# EAGLE design Teensylu (EAGLE 5.11)
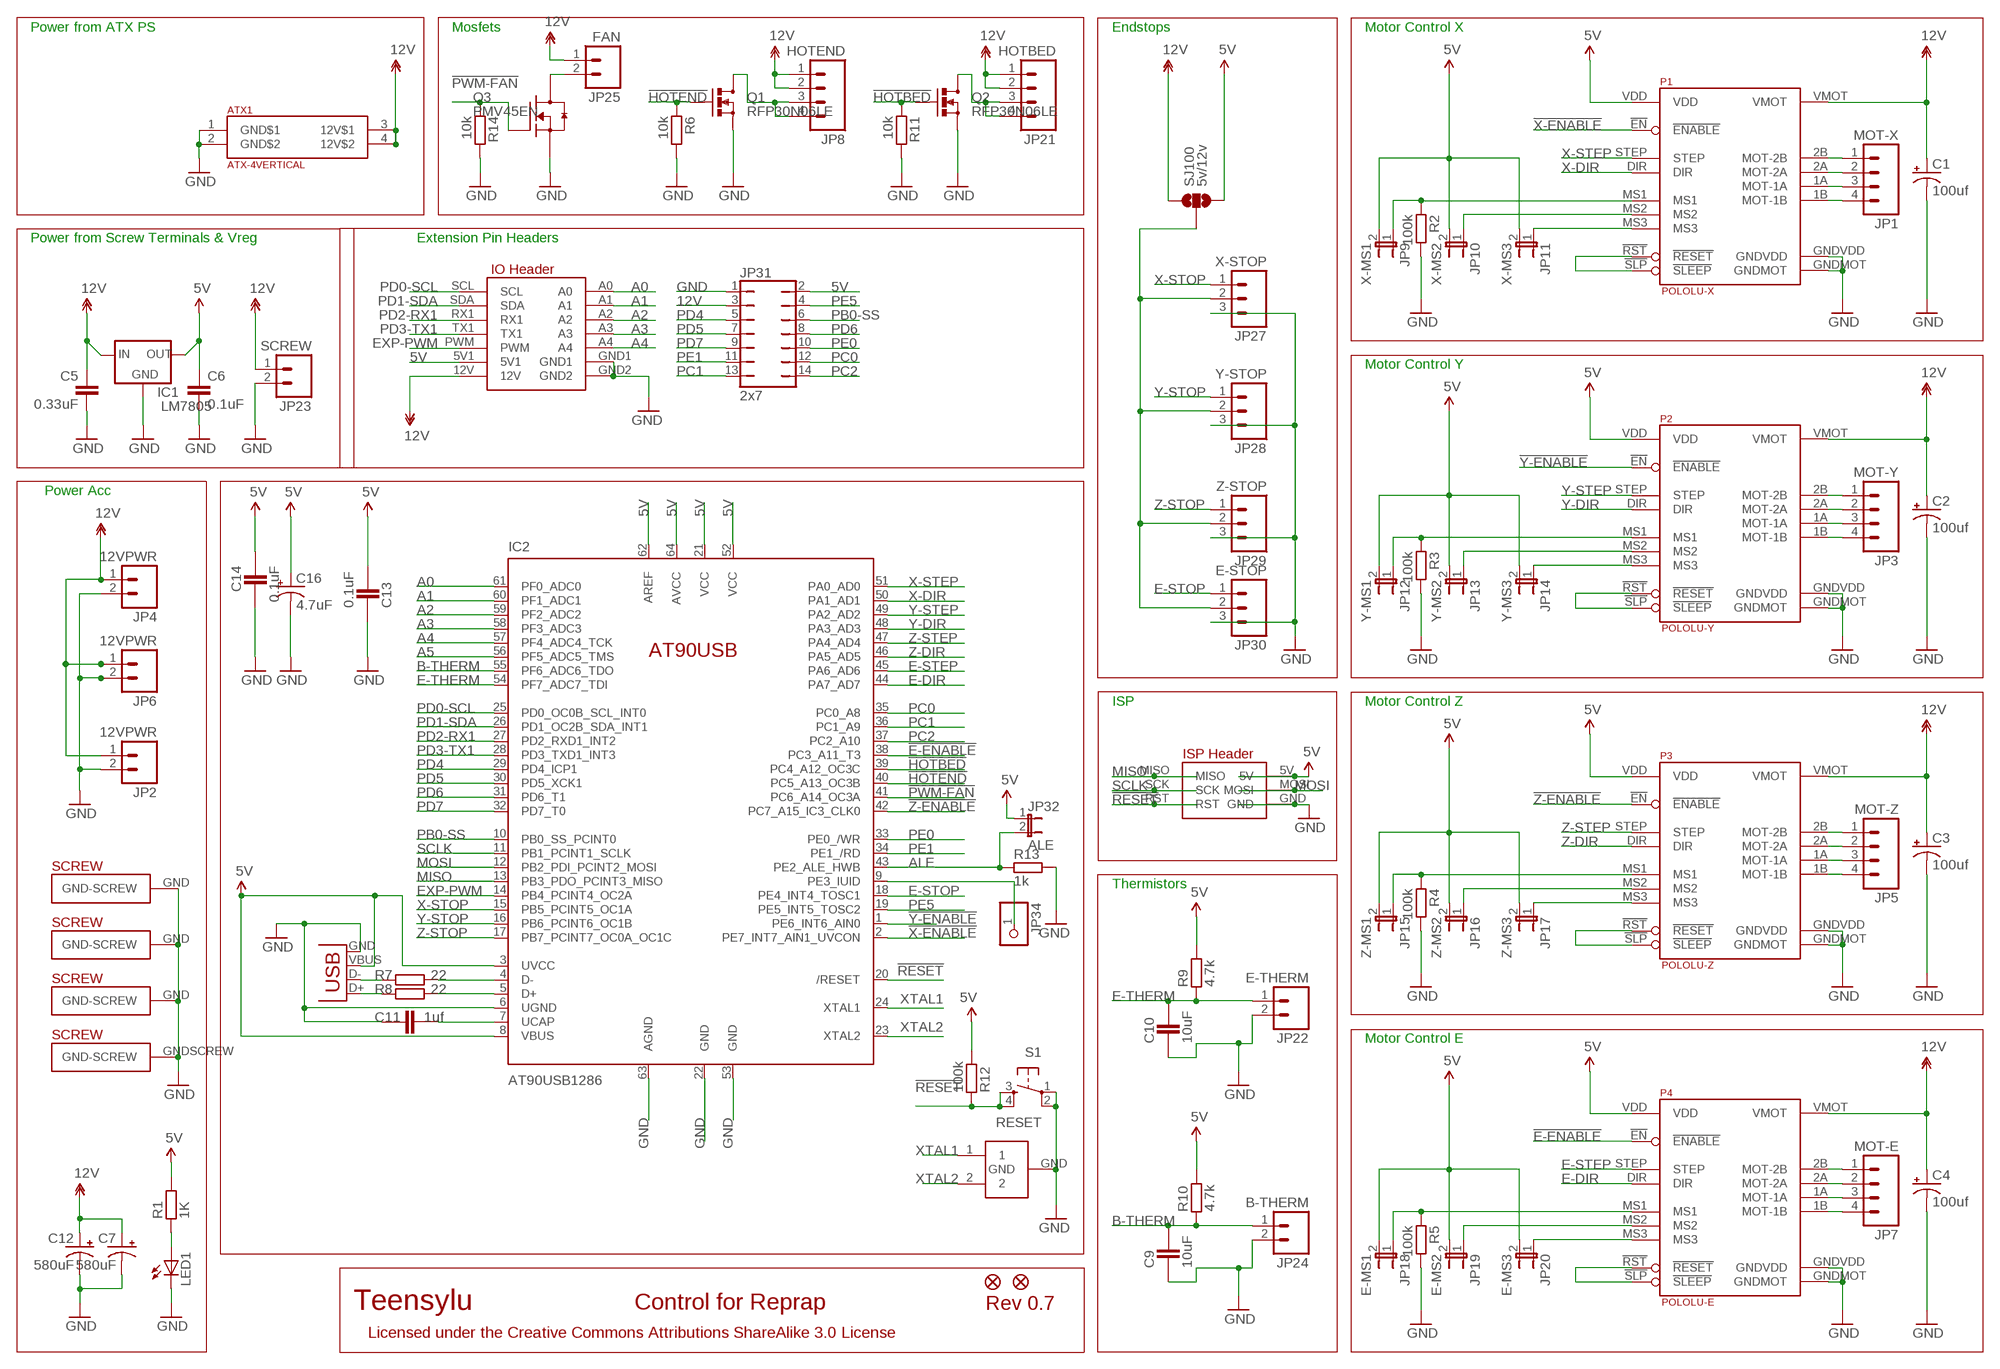
[diagram p0: schematic, sheet 1]

## Parts
ATX1  ATX-4VERTICAL  [MINIFITJR-4-VERTICAL]
C1  100uf  CAP_POLPTH1  [CPOL-RADIAL-100UF-25V]
C2  100uf  CAP_POLPTH1  [CPOL-RADIAL-100UF-25V]
C3  100uf  CAP_POLPTH1  [CPOL-RADIAL-100UF-25V]
C4  100uf  CAP_POLPTH1  [CPOL-RADIAL-100UF-25V]
C5  0.33uF  CAPPTH2  [CAP-PTH-SMALL2]
C6  0.1uF  CAPPTH2  [CAP-PTH-SMALL2]
C7  580uF  CAP_POLPTH4  [CPOL-RADIAL-1000UF-25V]
C9  10uF  CAPACITOR_0805  [CAPC2012X145AN]
C10  10uF  CAPACITOR_0805  [CAPC2012X145AN]
C11  1uf  CAPACITOR_0805  [CAPC2012X145AN]
C12  580uF  CAP_POLPTH4  [CPOL-RADIAL-1000UF-25V]
C13  0.1uF  CAPACITOR_0805  [CAPC2012X145AN]
C14  0.1uF  CAPACITOR_0805  [CAPC2012X145AN]
C16  4.7uF  CAP_POLPTH2  [CPOL-RADIAL-10UF-25V]
IC1  LM7805  V_REG_78XX  [78XXL-CUSTOM]
IC2  AT90USB1286  AT90USB  [TQFP64-2]
J1  USB  USBPTH  [USB-B-PTH]
JP1  MOT-X  M04POLAR  [MOLEX-1X4]
JP2  12VPWR  M02POLAR  [MOLEX-1X2]
JP3  MOT-Y  M04POLAR  [MOLEX-1X4]
JP4  12VPWR  M02POLAR  [MOLEX-1X2]
JP5  MOT-Z  M04POLAR  [MOLEX-1X4]
JP6  12VPWR  M02POLAR  [MOLEX-1X2]
JP7  MOT-E  M04POLAR  [MOLEX-1X4]
JP8  HOTEND  M04POLAR  [MOLEX-1X4]
JP9  X-MS1  JUMPER-2PTH  [1X02]
JP10  X-MS2  JUMPER-2PTH  [1X02]
JP11  X-MS3  JUMPER-2PTH  [1X02]
JP12  Y-MS1  JUMPER-2PTH  [1X02]
JP13  Y-MS2  JUMPER-2PTH  [1X02]
JP14  Y-MS3  JUMPER-2PTH  [1X02]
JP15  Z-MS1  JUMPER-2PTH  [1X02]
JP16  Z-MS2  JUMPER-2PTH  [1X02]
JP17  Z-MS3  JUMPER-2PTH  [1X02]
JP18  E-MS1  JUMPER-2PTH  [1X02]
JP19  E-MS2  JUMPER-2PTH  [1X02]
JP20  E-MS3  JUMPER-2PTH  [1X02]
JP21  HOTBED  M04POLAR  [MOLEX-1X4]
JP22  E-THERM  M02PTH  [1X02]
JP23  SCREW  M025MM  [SCREWTERMINAL-5MM-2]
JP24  B-THERM  M02PTH  [1X02]
JP25  FAN  M02PTH  [1X02]
JP26  FIDUCIAL1X2.5  [FIDUCIAL-1X2.5]
JP27  X-STOP  M03POLAR  [MOLEX-1X3]
JP28  Y-STOP  M03POLAR  [MOLEX-1X3]
JP29  Z-STOP  M03POLAR  [MOLEX-1X3]
JP30  E-STOP  M03POLAR  [MOLEX-1X3]
JP31  2x7  JP7Q  [JP7Q]
JP32  ALE  JUMPER-2PTH  [1X02]
JP33  FIDUCIAL1X2.5  [FIDUCIAL-1X2.5]
JP34  PINHD-1X1  [1X01]
LED1  LED5MM  [LED5MM]
P1  POLOLU-X  POLOLU-ALLEGRO  [POLOLU-ALLEGRO-PTH]
P2  POLOLU-Y  POLOLU-ALLEGRO  [POLOLU-ALLEGRO-PTH]
P3  POLOLU-Z  POLOLU-ALLEGRO  [POLOLU-ALLEGRO-PTH]
P4  POLOLU-E  POLOLU-ALLEGRO  [POLOLU-ALLEGRO-PTH]
Q1  RFP30N06LE  MOSFET-NCHANNELPTH2  [TO220V]
Q2  RFP30N06LE  MOSFET-NCHANNELPTH2  [TO220V]
Q3  PMV45EN  MOSFET-NCH_SOT-23  [SOT95P280X135-3N]
R1  1K  RESISTOR_0805  [RESC2012X70N]
R2  100k  RESISTOR_0805  [RESC2012X70N]
R3  100k  RESISTOR_0805  [RESC2012X70N]
R4  100k  RESISTOR_0805  [RESC2012X70N]
R5  100k  RESISTOR_0805  [RESC2012X70N]
R6  10k  RESISTOR_0805  [RESC2012X70N]
R7  22  RESISTOR_0805  [RESC2012X70N]
R8  22  RESISTOR_0805  [RESC2012X70N]
R9  4.7k  RESISTOR_0805  [RESC2012X70N]
R10  4.7k  RESISTOR_0805  [RESC2012X70N]
R11  10k  RESISTOR_0805  [RESC2012X70N]
R12  100k  RESISTOR_0805  [RESC2012X70N]
R13  1k  RESISTOR_0805  [RESC2012X70N]
R14  10k  RESISTOR_0805  [RESC2012X70N]
S1  RESET  TAC_SWITCHPTH  [TACTILE-PTH]
SJ100  5v/12v  SOLDERJUMPER_2WAYW  [SJ_2W]
U$17  PLATED-SCREW  [PLATEDSCREW]
U$24  PLATED-SCREW  [PLATEDSCREW]
U$34  IO_HEADERS_SCREW  [IO_HEADER-PLATEDSCREW]
U$37  PLATED-SCREW  [PLATEDSCREW]
XTAL  KYOCERA_PQRC_TYPE_S_RESONATOR  [AVX_3.2X1.3_RESONATOR]

## Nets
5V: C6.1 C13.2 C14.1 C16.1(+) IC1.OUT IC2.3(UVCC) IC2.8(VBUS) IC2.21(VCC) IC2.52(VCC) IC2.62(AREF) IC2.64(AVCC) J1.VBUS JP9.2 JP10.2 JP11.2 JP12.2 JP13.2 JP14.2 JP15.2 JP16.2 JP17.2 JP18.2 JP19.2 JP20.2 JP31.2 JP32.1 P1.VDD P2.VDD P3.VDD P4.VDD R1.2 R9.2 R10.2 R12.2 SJ100.3 U$34.5V U$34.5V1
12V: ATX1.3(12V$1) ATX1.4(12V$2) C1.1(+) C2.1(+) C3.1(+) C4.1(+) C5.1 C7.1(+) C12.1(+) IC1.IN JP2.1 JP4.1 JP6.1 JP8.1 JP8.2 JP21.1 JP21.2 JP23.1 JP25.1 JP31.3 P1.VMOT P2.VMOT P3.VMOT P4.VMOT SJ100.1 U$34.12V
!E-ENABLE: IC2.38(PC3_A11_T3) P4.!EN(!ENABLE)
!HOTBED: IC2.39(PC4_A12_OC3C) Q2.1(G) R11.1
!HOTEND: IC2.40(PC5_A13_OC3B) Q1.1(G) R6.1
!PWM-FAN: IC2.41(PC6_A14_OC3A) Q3.1(G) R14.1
!RESET: IC2.20(/RESET) R12.1 S1.3 S1.4 U$34.RST
!X-ENABLE: IC2.2(PE7_INT7_AIN1_UVCON) P1.!EN(!ENABLE)
!Y-ENABLE: IC2.1(PE6_INT6_AIN0) P2.!EN(!ENABLE)
!Z-ENABLE: IC2.42(PC7_A15_IC3_CLK0) P3.!EN(!ENABLE)
A0: IC2.61(PF0_ADC0) U$34.A0
A1: IC2.60(PF1_ADC1) U$34.A1
A2: IC2.59(PF2_ADC2) U$34.A2
A3: IC2.58(PF3_ADC3) U$34.A3
A4: IC2.57(PF4_ADC4_TCK) U$34.A4
A5: IC2.56(PF5_ADC5_TMS)
ALE: IC2.43(PE2_ALE_HWB) JP32.2 R13.1
B-THERM: C9.2 IC2.55(PF6_ADC6_TDO) JP24.1 R10.1
E-DIR: IC2.44(PA7_AD7) P4.DIR
E-MOT-1A [power]: JP7.3 P4.1A(MOT-1A)
E-MOT-1B [power]: JP7.4 P4.1B(MOT-1B)
E-MOT-2A [power]: JP7.2 P4.2A(MOT-2A)
E-MOT-2B [power]: JP7.1 P4.2B(MOT-2B)
E-MS1: JP18.1 P4.MS1 R5.1
E-MS2: JP19.1 P4.MS2
E-MS3: JP20.1 P4.MS3
E-RESETSLEEP: P4.!RST(!RESET) P4.!SLP(!SLEEP)
E-STEP: IC2.45(PA6_AD6) P4.STEP
E-STOP: IC2.18(PE4_INT4_TOSC1) JP30.1
E-THERM: C10.2 IC2.54(PF7_ADC7_TDI) JP22.1 R9.1
ENDSTOP+V: JP27.2 JP28.2 JP29.2 JP30.2 SJ100.2
EXP-PWM: IC2.14(PB4_PCINT4_OC2A) U$34.PWM
GND [power]: ATX1.1(GND$1) ATX1.2(GND$2) C1.2(-) C2.2(-) C3.2(-) C4.2(-) C5.2 C6.2 C7.2(-) C9.1 C10.1 C11.1 C12.2(-) C13.1 C14.2 C16.2(-) IC1.GND IC2.6(UGND) IC2.22(GND) IC2.53(GND) IC2.63(AGND) J1.GND JP2.2 JP4.2 JP6.2 JP22.2 JP23.2 JP24.2 JP27.3 JP28.3 JP29.3 JP30.3 JP31.1 LED1.K(C) P1.GNDMOT P1.GNDVDD P2.GNDMOT P2.GNDVDD P3.GNDMOT P3.GNDVDD P4.GNDMOT P4.GNDVDD Q1.3(S) Q2.3(S) Q3.2(S) R2.2 R3.2 R4.2 R5.2 R6.2 R11.2 R13.2 R14.2 S1.1 S1.2 U$17.GND(GND-SCREW) U$24.GND(GND-SCREW) U$34.GND U$34.GND1 U$34.GND2 U$34.GNDSCREW(GND-SCREW) U$37.GND(GND-SCREW) XTAL.GND
HOTBED-GND [power]: JP21.3 JP21.4 Q2.2(D)
HOTEND-GND [power]: JP8.3 JP8.4 Q1.2(D)
MISO: IC2.13(PB3_PDO_PCINT3_MISO) U$34.MISO
MOSI: IC2.12(PB2_PDI_PCINT2_MOSI) U$34.MOSI
N$1: LED1.A R1.1
N$2: J1.D- R7.1
N$3: IC2.4(D-) R7.2
N$4: IC2.5(D+) R8.2
N$5: J1.D+ R8.1
N$6: JP25.2 Q3.3(D)
N$7: IC2.9(PE3_IUID) JP34.1
N$9: C11.2 IC2.7(UCAP)
PB0-SS: IC2.10(PB0_SS_PCINT0) JP31.6
PC0: IC2.35(PC0_A8) JP31.12
PC1: IC2.36(PC1_A9) JP31.13
PC2: IC2.37(PC2_A10) JP31.14
PD0-SCL: IC2.25(PD0_OC0B_SCL_INT0) U$34.SCL
PD1-SDA: IC2.26(PD1_OC2B_SDA_INT1) U$34.SDA
PD2-RX1: IC2.27(PD2_RXD1_INT2) U$34.RX1
PD3-TX1: IC2.28(PD3_TXD1_INT3) U$34.TX1
PD4: IC2.29(PD4_ICP1) JP31.5
PD5: IC2.30(PD5_XCK1) JP31.7
PD6: IC2.31(PD6_T1) JP31.8
PD7: IC2.32(PD7_T0) JP31.9
PE0: IC2.33(PE0_/WR) JP31.10
PE1: IC2.34(PE1_/RD) JP31.11
PE5: IC2.19(PE5_INT5_TOSC2) JP31.4
SCLK: IC2.11(PB1_PCINT1_SCLK) U$34.SCK
X-DIR: IC2.50(PA1_AD1) P1.DIR
X-MOT-1A [power]: JP1.3 P1.1A(MOT-1A)
X-MOT-1B [power]: JP1.4 P1.1B(MOT-1B)
X-MOT-2A [power]: JP1.2 P1.2A(MOT-2A)
X-MOT-2B [power]: JP1.1 P1.2B(MOT-2B)
X-MS1: JP9.1 P1.MS1 R2.1
X-MS2: JP10.1 P1.MS2
X-MS3: JP11.1 P1.MS3
X-RESETSLEEP: P1.!RST(!RESET) P1.!SLP(!SLEEP)
X-STEP: IC2.51(PA0_AD0) P1.STEP
X-STOP: IC2.15(PB5_PCINT5_OC1A) JP27.1
XTAL1: IC2.24(XTAL1) XTAL.1
XTAL2: IC2.23(XTAL2) XTAL.2
Y-DIR: IC2.48(PA3_AD3) P2.DIR
Y-MOT-1A [power]: JP3.3 P2.1A(MOT-1A)
Y-MOT-1B [power]: JP3.4 P2.1B(MOT-1B)
Y-MOT-2A [power]: JP3.2 P2.2A(MOT-2A)
Y-MOT-2B [power]: JP3.1 P2.2B(MOT-2B)
Y-MS1: JP12.1 P2.MS1 R3.1
Y-MS2: JP13.1 P2.MS2
Y-MS3: JP14.1 P2.MS3
Y-RESETSLEEP: P2.!RST(!RESET) P2.!SLP(!SLEEP)
Y-STEP: IC2.49(PA2_AD2) P2.STEP
Y-STOP: IC2.16(PB6_PCINT6_OC1B) JP28.1
Z-DIR: IC2.46(PA5_AD5) P3.DIR
Z-MOT-1A [power]: JP5.3 P3.1A(MOT-1A)
Z-MOT-1B [power]: JP5.4 P3.1B(MOT-1B)
Z-MOT-2A [power]: JP5.2 P3.2A(MOT-2A)
Z-MOT-2B [power]: JP5.1 P3.2B(MOT-2B)
Z-MS1: JP15.1 P3.MS1 R4.1
Z-MS2: JP16.1 P3.MS2
Z-MS3: JP17.1 P3.MS3
Z-RESETSLEEP: P3.!RST(!RESET) P3.!SLP(!SLEEP)
Z-STEP: IC2.47(PA4_AD4) P3.STEP
Z-STOP: IC2.17(PB7_PCINT7_OC0A_OC1C) JP29.1

## Notes on the sheet
- Power from ATX PS | Mosfets | Endstops | Motor Control X
- Power from Screw Terminals & Vreg | Extension Pin Headers
- Motor Control Y
- Power Acc
- ISP | Motor Control Z
- Thermistors
- Motor Control E
- Teensylu | Control for Reprap | Rev 0.7
- Licensed under the Creative Commons Attributions ShareAlike 3.0 License

## Library data of the parts
ATX1 = atx-power-supply:ATX-4
C1-C4 C7 C12 C16 = SparkFun:CAP_POL: Capacitor Polarized These are standard SMD and PTH capacitors. Normally 10uF, 47uF, and 100uF in electrolytic and tantalum varieties. Always verify the external diameter of the through hole cap, it varies with capacity, voltage, and manufacturer. The EIA devices should be standard.
C5 C6 = SparkFun:CAP: Capacitor Standard 0603 ceramic capacitor, and 0.1" leaded capacitor.
C9-C11 C13 C14 = ipc-7351-capacitor:CAPACITOR_
IC1 = SparkFun:V_REG_78XX: Voltage Regulator Standard 7805 5V regulator. IGO (Input Ground Output). Spark Fun Electronics SKU : COM-00107
IC2 = Atmel-at90usb-teensy:AT90USB
J1 = SparkFun:USB: USB Connectors USB-B-PTH is fully proven SKU : PRT-00139 USB-miniB is fully proven SKU : PRT-00587 USB-A-PCB is untested. USB-A-H is throughly reviewed, but untested. Spark Fun Electronics SKU : PRT-00437 USB-B-SMT is throughly reviewed, but untested. Needs silkscreen touching up. USB-A-S has not been used/tested USB-MB-H has not been used/tested
JP1 JP3 JP5 JP7 JP8 JP21 = SparkFun:M04: Header 4 Standard 4-pin 0.1" header. Use with straight break away headers (SKU : PRT-00116), right angle break away headers (PRT-00553), swiss pins (PRT-00743), machine pins (PRT-00117), and female headers (PRT-00115). Molex polarized connector foot print use with SKU : PRT-08231 with associated crimp pins and housings.
JP2 JP4 JP6 JP22-JP25 = SparkFun:M02: Header 2 Standard 2-pin 0.1" header. Use with straight break away headers (SKU : PRT-00116), right angle break away headers (PRT-00553), swiss pins (PRT-00743), machine pins (PRT-00117), and female headers (PRT-00115). Molex polarized connector foot print use with SKU : PRT-08233 with associated crimp pins and housings.
JP9-JP20 JP32 = SparkFun:JUMPER-2: Jumper Basic 0.1" spaced jumper. Use with breakaway headers.
JP26 JP33 = SparkFun:FIDUCIAL: Fiducial Alignment Points Various fiducial points for machine vision alignment.
JP27-JP30 = SparkFun:M03: Header 3 Standard 3-pin 0.1" header. Use with straight break away headers (SKU : PRT-00116), right angle break away headers (PRT-00553), swiss pins (PRT-00743), machine pins (PRT-00117), and female headers (PRT-00115). Molex polarized connector foot print use with SKU : PRT-08232 with associated crimp pins and housings.
JP31 = jumper:JP7Q: JUMPER
JP34 = pinhead:PINHD-1X1: PIN HEADER
LED1 = led:LED: LED OSRAM: - CHIPLED LG R971, LG N971, LY N971, LG Q971, LY Q971, LO R971, LY R971 LH N974, LH R974 LS Q976, LO Q976, LY Q976 LO Q996 - Hyper CHIPLED LW Q18S LB Q993, LB Q99A, LB R99A - SideLED LS A670, LO A670, LY A670, LG A670, LP A670 LB A673, LV A673, LT A673, LW A673 LH A674 LY A675 LS A676, LA A676, LO A676, LY A676, LW A676 LS A679, LY A679, LG A679 - Hyper Micro SIDELED® LS Y876, LA Y876, LO Y876, LY Y876 LT Y87S - SmartLED LW L88C, LW L88S LB L89C, LB L89S, LG L890 LS L89K, LO L89K, LY L89K LS L896, LA L896, LO L896, LY L896 - TOPLED LS T670, LO T670, LY T670, LG T670, LP T670 LSG T670, LSP T670, LSY T670, LOP T670, LYG T670 LG T671, LOG T671, LSG T671 LB T673, LV T673, LT T673, LW T673 LH T674 LS T676, LA T676, LO T676, LY T676, LB T676, LH T676, LSB T676, LW T676 LB T67C, LV T67C, LT T67C, LS T67K, LO T67K, LY T67K, LW E67C LS E67B, LA E67B, LO E67B, LY E67B, LB E67C, LV E67C, LT E67C LW T67C LS T679, LY T679, LG T679 LS T770, LO T770, LY T770, LG T770, LP T770 LB T773, LV T773, LT T773, LW T773 LH T774 LS E675, LA E675, LY E675, LS T675 LS T776, LA T776, LO T776, LY T776, LB T776 LHGB T686 LT T68C, LB T68C - Hyper Mini TOPLED® LB M676 - Mini TOPLED Santana® LG M470 LS M47K, LO M47K, LY M47K Source: http://www.osram.convergy.de LUXEON: - LUMILED® LXK2-PW12-R00, LXK2-PW12-S00, LXK2-PW14-U00, LXK2-PW14-V00 LXK2-PM12-R00, LXK2-PM12-S00, LXK2-PM14-U00 LXK2-PE12-Q00, LXK2-PE12-R00, LXK2-PE12-S00, LXK2-PE14-T00, LXK2-PE14-U00 LXK2-PB12-K00, LXK2-PB12-L00, LXK2-PB12-M00, LXK2-PB14-N00, LXK2-PB14-P00, LXK2-PB14-Q00 LXK2-PR12-L00, LXK2-PR12-M00, LXK2-PR14-Q00, LXK2-PR14-R00 LXK2-PD12-Q00, LXK2-PD12-R00, LXK2-PD12-S00 LXK2-PH12-R00, LXK2-PH12-S00 LXK2-PL12-P00, LXK2-PL12-Q00, LXK2-PL12-R00 Source: www.luxeon.com KINGBRIGHT: KA-3528ASYC Source: www.kingbright.com
P1-P4 = pololu-allegro:POLOLU-ALLEGRO
Q1 Q2 = SparkFun:MOSFET-NCHANNEL
Q3 = ipc-7351-transistor:MOSFET-NCH_
R1-R14 = ipc-7351-resistor:RESISTOR_
S1 = SparkFun:TAC_SWITCH: Momentary Switch Button commonly used for reset or general input. Spark Fun Electronics SKU : COM-00097
SJ100 = SparkFun:SOLDERJUMPER_2WAY: Solder Jumper 2 way solder jumper
U$17 U$24 U$37 = Sanguinololu:PLATED-SCREW
U$34 = Sanguinololu:IO_HEADERS_SCREW
XTAL = Kyocera_Resonator:KYOCERA_PQRC_TYPE_S_RESONATOR

## Board
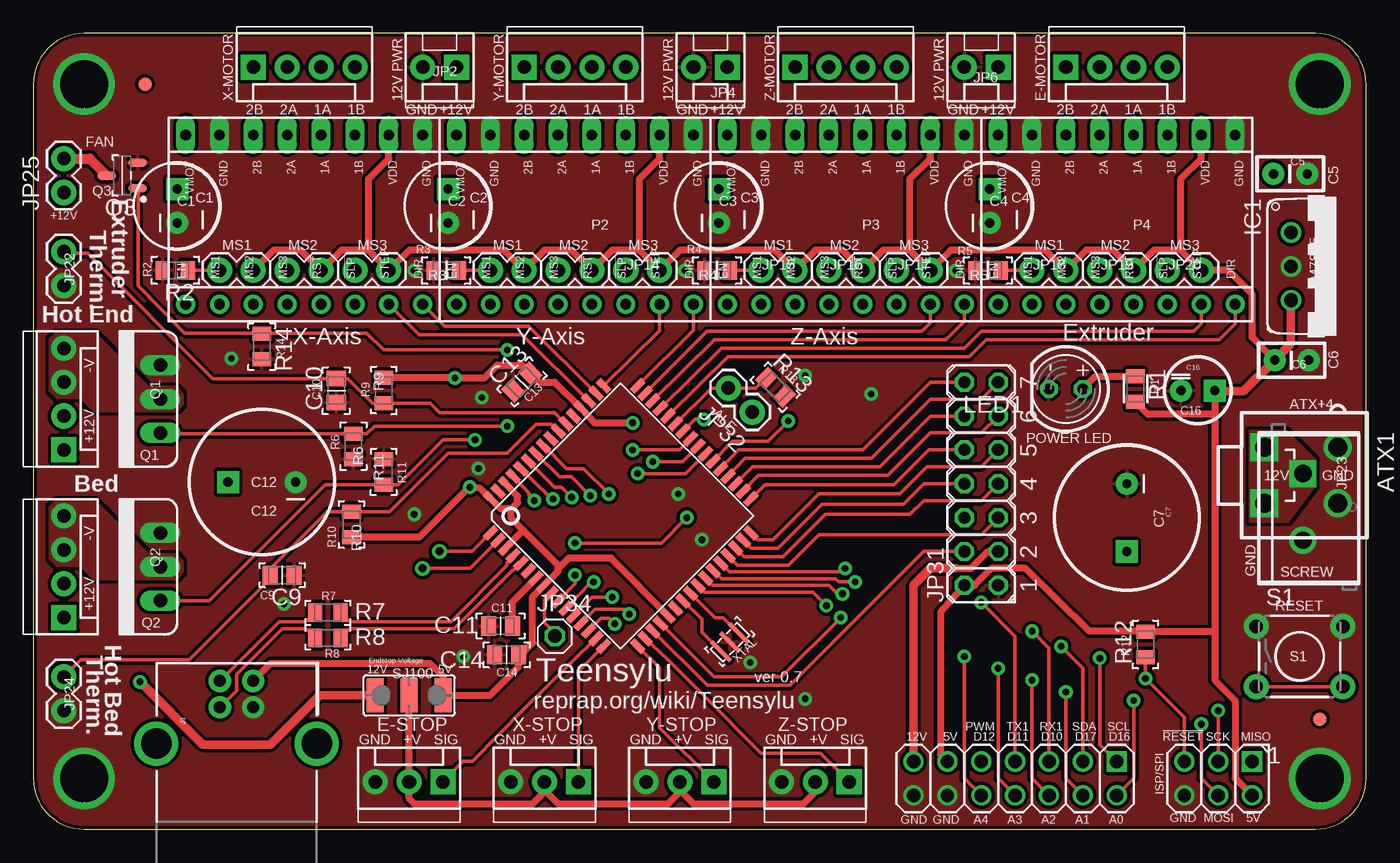
[diagram p1: board, top side]
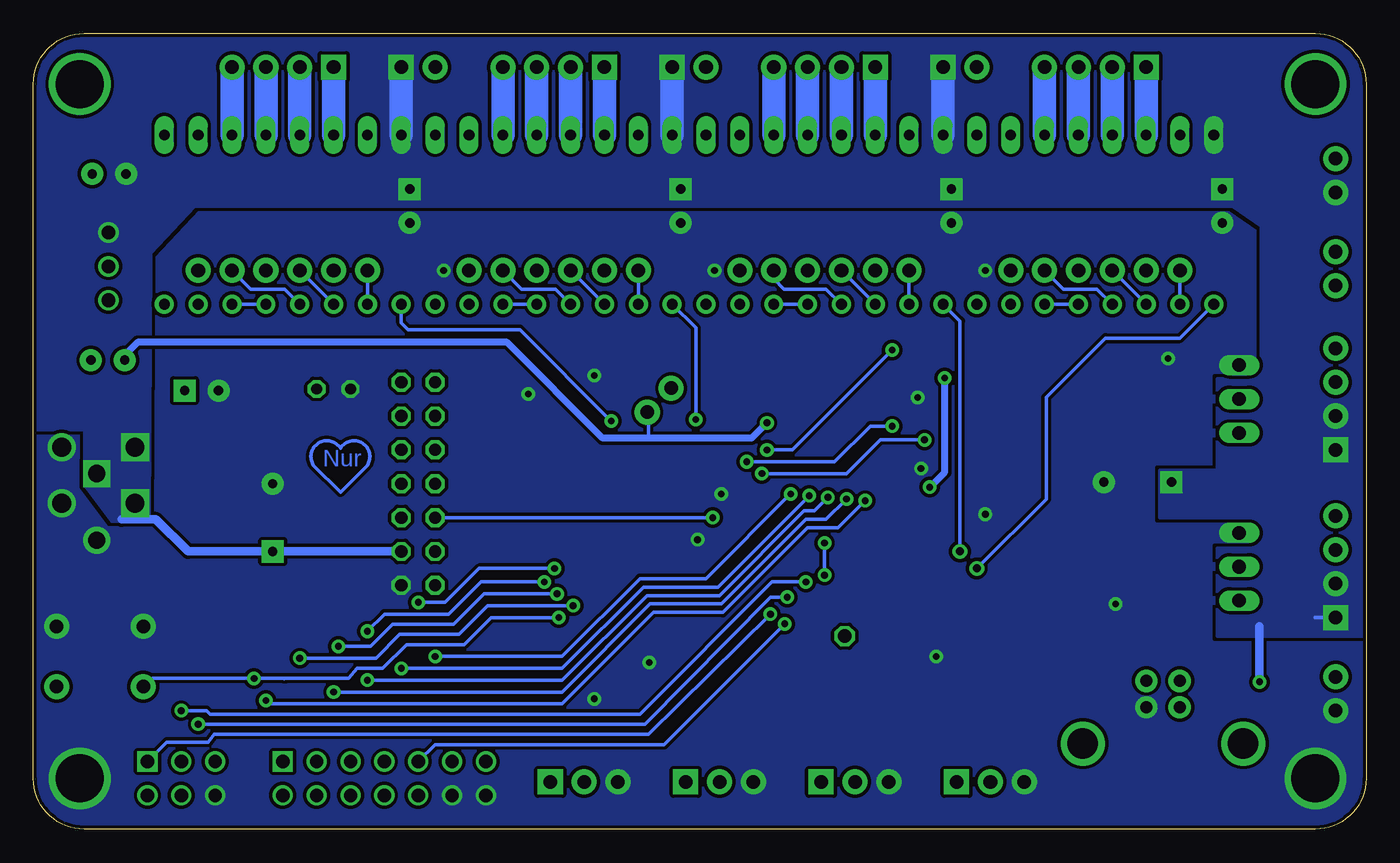
[diagram p2: board, bottom side, seen from below]

Size 100 x 59.69 mm. Coordinates in mm from the lower left corner, seen from the top.
Outline: 0,3.81 arc90 3.81,0 96.19,0 arc90 100,3.81 100,55.88 arc90 96.19,59.69 3.81,59.69 arc90 0,55.88 0,3.81
Copper layers (1*16): Top 0.035mm / dielectric 1.5mm / Bottom 0.035mm
Design rules "10width10space20drill10annular": minimum track width 10mil, minimum drill 20mil, track to track 10mil, track to pad 10mil, pad to pad 10mil, via to via 10mil, smd to smd 0mil, copper to edge 10mil, drill to drill 10mil, minimum pad ring 10mil, minimum via ring 10mil, stop-mask expansion 2mil, vias tented up to drill 25mil, thermal gap 10mil

### Footprints (pad centres in the part's own frame; a part is rotated, then mirrored left to right if it is on the bottom)
MINIFITJR-4-VERTICAL = drill 1.4 round: 1 2.1,-2.75; 2 -2.1,-2.75 | drill 1.4 square: 3 2.1,2.75; 4 -2.1,2.75
CPOL-RADIAL-100UF-25V = drill 0.7 pad 1.651 square: 1 1.27,0 | drill 0.7 pad 1.651 round: 2 -1.27,0
CAP-PTH-SMALL2 = drill 0.7 pad 1.651 round: 1 0,0; 2 2.54,0
CPOL-RADIAL-1000UF-25V = drill 0.7 pad 1.651 square: 1 2.54,0 | drill 0.7 pad 1.651 round: 2 -2.54,0
CAPC2012X145AN = smd 1.15 x 1.45: 1 -0.9,0; 2 0.9,0
CPOL-RADIAL-10UF-25V = drill 0.7 pad 1.651 square: 1 1.27,0 | drill 0.7 pad 1.651 round: 2 -1.27,0
78XXL-CUSTOM = drill 1.016 round: GND 0,0; IN -2.54,0; OUT 2.54,0
TQFP64-2 = smd 1.194 x 0.508: 1 -7.8,6; 2 -7.8,5.2; 3 -7.8,4.4; 4 -7.8,3.6; 5 -7.8,2.8; 6 -7.8,2; 7 -7.8,1.2; 8 -7.8,0.4; 9 -7.8,-0.4; 10 -7.8,-1.2; 11 -7.8,-2; 12 -7.8,-2.8; 13 -7.8,-3.6; 14 -7.8,-4.4; 15 -7.8,-5.2; 16 -7.8,-6; 33 7.8,-6; 34 7.8,-5.2; 35 7.8,-4.4; 36 7.8,-3.6; 37 7.8,-2.8; 38 7.8,-2; 39 7.8,-1.2; 40 7.8,-0.4; 41 7.8,0.4; 42 7.8,1.2; 43 7.8,2; 44 7.8,2.8; 45 7.8,3.6; 46 7.8,4.4; 47 7.8,5.2; 48 7.8,6 | smd 0.508 x 1.194: 17 -6,-7.8; 18 -5.2,-7.8; 19 -4.4,-7.8; 20 -3.6,-7.8; 21 -2.8,-7.8; 22 -2,-7.8; 23 -1.2,-7.8; 24 -0.4,-7.8; 25 0.4,-7.8; 26 1.2,-7.8; 27 2,-7.8; 28 2.8,-7.8; 29 3.6,-7.8; 30 4.4,-7.8; 31 5.2,-7.8; 32 6,-7.8; 49 6,7.8; 50 5.2,7.8; 51 4.4,7.8; 52 3.6,7.8; 53 2.8,7.8; 54 2,7.8; 55 1.2,7.8; 56 0.4,7.8; 57 -0.4,7.8; 58 -1.2,7.8; 59 -2,7.8; 60 -2.8,7.8; 61 -3.6,7.8; 62 -4.4,7.8; 63 -5.2,7.8; 64 -6,7.8
USB-B-PTH = drill 0.914 pad 1.676 round: D+ 0,1.25; D- 1.981,1.25; GND 0,-1.25; VBUS 1.981,-1.25 | drill 2.286 round: P$1 -2.718,-6.02; P$2 -2.718,6.02
MOLEX-1X4 = drill 1.016 pad 1.88 square: 1 0,0 | drill 1.016 pad 1.88 round: 2 2.54,0; 3 5.08,0; 4 7.62,0
MOLEX-1X2 = drill 1.016 pad 1.88 square: 1 0,0 | drill 1.016 pad 1.88 round: 2 2.54,0
1X02 = drill 1.016 pad 1.88 round: 1 0,0; 2 2.54,0
SCREWTERMINAL-5MM-2 = drill 1.3 pad 2.032 square: 1 0,0 | drill 1.3 pad 2.032 round: 2 5,0
FIDUCIAL-1X2.5 = smd 1 x 1: 1 0,0
MOLEX-1X3 = drill 1.016 pad 1.88 square: 1 0,0 | drill 1.016 pad 1.88 round: 2 2.54,0; 3 5.08,0
JP7Q = drill 0.914 octagon: 1 -7.62,-1.27; 2 -7.62,1.27; 3 -5.08,-1.27; 4 -5.08,1.27; 5 -2.54,-1.27; 6 -2.54,1.27; 7 0,-1.27; 8 0,1.27; 9 2.54,-1.27; 10 2.54,1.27; 11 5.08,-1.27; 12 5.08,1.27; 13 7.62,-1.27; 14 7.62,1.27
1X01 = drill 1.016 octagon: 1 0,0
LED5MM = drill 0.813 octagon: A -1.27,0; K 1.27,0
POLOLU-ALLEGRO-PTH = drill 0.8 pad 1.422 long: 1A 6.35,-1.27; 1B 6.35,-3.81; 2A 6.35,1.27; 2B 6.35,3.81; GNDMOT 6.35,6.35; GNDVDD 6.35,-8.89; VDD 6.35,-6.35; VMOT 6.35,8.89 | drill 0.8 pad 1.422 round: !EN -6.35,8.89; !RST -6.35,-1.27; !SLP -6.35,-3.81; DIR -6.35,-8.89; MS1 -6.35,6.35; MS2 -6.35,3.81; MS3 -6.35,1.27; STEP -6.35,-6.35
TO220V = drill 1.016 long: 1 -2.54,0; 2 0,0; 3 2.54,0
SOT95P280X135-3N = smd 1.4 x 0.65: 1 -1.15,0.95; 2 -1.15,-0.95; 3 1.15,0
RESC2012X70N = smd 1.05 x 1.4: 1 -0.95,0; 2 0.95,0
TACTILE-PTH = drill 1.016 pad 1.88 round: 1 -3.251,2.261; 2 3.251,2.261; 3 -3.251,-2.261; 4 3.251,-2.261
SJ_2W = smd 1.27 x 2.54: 1 -2.54,0; 2 0,0; 3 2.54,0
PLATEDSCREW = drill 3.6 round: GND 0,0
IO_HEADER-PLATEDSCREW = drill 1 round: 5V -5.08,-1.27; 5V1 -27.94,1.27; 12V -30.48,1.27; A0 -15.24,-1.27; A1 -17.78,-1.27; A2 -20.32,-1.27; A3 -22.86,-1.27; A4 -25.4,-1.27; GND -10.16,-1.27; GND1 -27.94,-1.27; GND2 -30.48,-1.27; MOSI -7.62,-1.27; PWM -25.4,1.27; RST -10.16,1.27; RX1 -20.32,1.27; SCK -7.62,1.27; SDA -17.78,1.27; TX1 -22.86,1.27 | drill 3.6 round: GNDSCREW 0,0 | drill 1 square: MISO -5.08,1.27; SCL -15.24,1.27
AVX_3.2X1.3_RESONATOR = smd 0.3 x 2: 1 -0.95,0; 2 0.95,0; GND 0,0

### Placement (x,y rotation side)
ATX1  95.12,26.54 90 top
C1  10.79,46.74 90 top
C2  31.11,46.74 90 top
C3  51.44,46.74 90 top
C4  71.75,46.74 90 top
C5  93.04,49.15 0 top
C6  93.14,35.18 0 top
C7  82.04,23.37 270 top
C9  18.67,19.05 180 top
C10  22.73,32.89 90 top
C11  35.05,15.24 0 top
C12  17.14,26.04 180 top
C13  36.65,33.53 45 top
C14  35.51,13.08 180 top
C16  87.38,32.89 0 top
IC1  94.36,42.21 270 top
IC2  44.07,23.5 45 top
J1  15.24,9.14 90 top
JP1  16.51,57.15 0 top
JP2  31.75,57.15 180 top
JP3  36.83,57.15 0 top
JP4  52.07,57.15 180 top
JP5  57.15,57.15 0 top
JP6  72.39,57.15 180 top
JP7  77.47,57.15 0 top
JP8  2.29,28.45 90 top
JP9  13.97,41.91 0 top
JP10  19.05,41.91 0 top
JP11  24.13,41.91 0 top
JP12  34.29,41.91 0 top
JP13  39.37,41.91 0 top
JP14  44.45,41.91 0 top
JP15  54.61,41.91 0 top
JP16  59.69,41.91 0 top
JP17  64.77,41.91 0 top
JP18  74.93,41.91 0 top
JP19  80.01,41.91 0 top
JP20  85.09,41.91 0 top
JP21  2.29,15.88 90 top
JP22  2.29,43.31 270 top
JP23  95.25,26.67 270 top
JP24  2.29,11.43 270 top
JP25  2.29,47.75 90 top
JP26  8.38,55.88 0 top
JP27  30.73,3.56 180 top
JP28  40.89,3.56 180 top
JP29  51.05,3.56 180 top
JP30  61.21,3.56 180 top
JP31  71.12,25.91 90 top
JP32  53.94,31.28 135 top
JP33  96.52,8.26 0 top
JP34  39.12,14.48 0 top
LED1  77.47,33.02 180 top
P1  20.32,45.72 90 top
P2  40.64,45.72 90 top
P3  60.96,45.72 90 top
P4  81.28,45.72 90 top
Q1  9.53,32.26 90 top
Q2  9.53,19.68 90 top
Q3  6.67,49.02 180 top
R1  82.68,33.02 270 top
R2  10.67,41.91 180 top
R3  30.99,41.91 180 top
R4  51.31,41.91 180 top
R5  71.63,41.91 180 top
R6  24,28.7 270 top
R7  22.1,16.26 0 top
R8  22.1,14.35 0 top
R9  26.29,32.89 90 top
R10  23.88,22.86 270 top
R11  26.29,26.8 90 top
R12  83.44,13.84 90 top
R13  55.67,33.16 315 top
R14  17.14,36.2 270 top
S1  95,12.95 0 top
SJ100  28.19,10.03 0 top
U$17  3.81,3.81 0 top
U$24  96.52,55.88 0 top
U$34  96.52,3.81 0 top
U$37  3.81,55.88 0 top
XTAL  52.27,14.02 225 top

### Tracks (layer width: path | path; a pad name or v marks a point on that pad's centre or on a via)
5V  (via drill 0.51)
  Top 0.254: v32.75,25.65 32.75,25.7 | C14.1 36.58,13.08 36.83,13.34 | R9.2
  Top 0.508: J1.VBUS 17.81,12.45 29.74,12.45 30.73,11.45 SJ100.3 34.26,10.03 36.41,12.18 C14.1 | IC2.21 43.35,20.32 43.35,20.35 40.19,20.35 39.37,19.53 | 36.83,13.34 37.47,13.97 37.47,17.45 IC2.8 39.37,19.35 39.37,19.53 | v44.96,30.48 42.09,30.48 IC2.52 39.11,33.53 37.92,33.53 C13.2 36.65,34.8 34.8,34.8 33.85,33.85 v31.62,33.85 R9.2 | U$34.5V1 68.07,5.59 68.07,16.26 JP31.2 70.61,18.29 71.88,19.56 74.41,19.56 79.24,14.86 83.44,14.86 R12.2 88.65,14.79 | 36.75,22.43 IC2.3 | U$34.5V 90.17,3.81 90.17,9.65 88.65,11.18 88.65,14.79 | 25.15,43.43 JP11.2 28.19,43.43 35.31,43.43 JP12.2 38.35,43.43 40.39,43.43 JP13.2 43.43,43.43 45.47,43.43 | 25.15,43.43 23.11,43.43 JP10.2 20.07,43.43 18.03,43.43 JP9.2 | 45.47,43.43 JP14.2 48.51,43.43 55.63,43.43 JP15.2 58.67,43.43 60.71,43.43 JP16.2 63.75,43.43 65.79,43.43 | 65.79,43.43 JP17.2 68.83,43.43 75.95,43.43 JP18.2 78.99,43.43 81.03,43.43 JP19.2 84.07,43.43 86.11,43.43 | 86.11,43.43 JP20.2 89.66,41.91 91.44,40.13 91.44,36.88 C6.1 | P1.VDD 26.67,50.29 25.15,48.77 25.15,43.43 | P2.VDD 46.99,50.29 45.47,48.77 45.47,43.43 | P3.VDD 67.31,50.29 65.79,48.77 65.79,43.43 | P4.VDD 87.63,50.29 86.11,48.77 86.11,43.43 | R10.2 28.96,21.91 32.75,25.7 | 35.86,24.01 36.34,24.48 36.34,24.98 IC2.62 | 36.75,22.43 35.86,23.32 35.86,24.01 | v32.75,25.65 32.78,25.68 33.53,25.56 IC2.64 35.07,24.02 35.85,24.02 35.86,24.01 | 36.75,22.43 39.37,19.81 39.37,19.53 | C16.1 88.65,31.11 | 88.65,31.11 83.63,31.11 R1.2 | 88.65,31.11 88.65,14.79
  Top 0.635: IC1.OUT 94.36,36.4 C6.1 90.79,32.83 88.65,32.83 C16.1
  Bottom 0.254: JP32.1 53.85,31.28 53.85,29.34
  Bottom 0.508: v44.96,30.48 46.1,29.34 53.85,29.34 57.28,29.34 64.45,36.51 92.19,36.51 93.14,35.56 C6.1 | v31.62,33.85 31.62,26.78 v32.75,25.65
12V  (via drill 0.51)
  Top 0.508: 69.22,19.56 70.36,19.56 71.63,20.83 JP31.3
  Top 0.635: v8,11.05 12.7,6.35 17.78,6.35 21.46,10.03 SJ100.1 | 69.22,19.56 67.31,19.56 66.04,18.29 U$34.12V
  Bottom 0.305: JP21.1 3.81,15.88
  Bottom 0.635: JP31.3 C7.1 88.39,20.83 90.81,23.24 93.39,23.24 | v8,11.05 8,15.24
  Bottom 1.778: P3.VMOT JP4.1 | P2.VMOT JP2.1 | P4.VMOT JP6.1
  pour Bottom (no thermals): -1.27,14.48 11.18,14.48 11.18,21.08 8.95,21.08 8.38,21.65 8.38,22.8 8.95,23.37 15.49,23.37 15.49,26.92 11.18,26.92 11.18,33.78 8.59,33.78 7.87,34.5 7.87,45.21 10.03,46.74 87.88,46.74 91.19,43.18 91.31,23.11 94.11,23.11 96.14,25.78 96.14,29.97 101.73,29.97 101.6,60.96 -1.27,60.96
  pour Top (no thermals): 96.14,25.78 94.11,23.11 91.31,23.11 91.31,29.84 93.98,29.84 96.14,27.69
!E-ENABLE  (via drill 0.51)
  Top 0.254: v56.64,30.61 55.12,29.08 52.44,29.08 IC2.38
  Bottom 0.254: P4.!EN 72.39,37.97 71.88,37.47 63.5,37.47 v56.64,30.61
!HOTBED  (via drill 0.51)
  Top 0.254: Q2.1 13.21,17.14 21.91,25.85 R11.1 27.37,25.85 30.73,29.2 v33.14,29.2 | v45.34,26.67 48.91,26.67 IC2.39
  Bottom 0.254: v45.34,26.67 38.99,26.67 36.46,29.2 v33.14,29.2
!HOTEND  (via drill 0.51)
  Top 0.254: v46.48,27.56 48.69,27.56 IC2.40 | v35.56,30.23 25.59,30.23 25.02,29.65 23.5,29.65 | 23.5,29.65 R6.1 | 23.5,29.65 9.53,29.65 Q1.1
  Bottom 0.254: v46.48,27.56 39.88,27.56 37.21,30.23 v35.56,30.23
!PWM-FAN  (via drill 0.51)
  Top 0.254: v44.96,28.45 48.47,28.45 IC2.41 | v35.56,35.94 26.29,35.94 25.02,37.21 17.21,37.21 | 17.21,37.21 R14.1 | Q3.1 7.87,48.07 7.87,40.77 11.37,37.21 17.21,37.21
  Bottom 0.254: v44.96,28.45 43.05,28.45 v35.56,35.94
!RESET  (via drill 0.51, 0.51 pad 1.02)
  Top 0.254: IC2.20 51.06,11.43 56.13,11.43 v60.58,15.88 | U$34.RST 86.36,8.38 v83.44,11.3 R12.1 | S1.3 S1.4
  Bottom 0.254: v60.58,15.88 65.66,15.88 67.69,13.84 72.01,13.84 73.79,12.06 75.69,12.06 76.33,11.3 81.05,11.3 | 81.05,11.3 81.18,11.3 | 81.05,11.3 v83.44,11.3 91.06,11.3 91.69,10.77 S1.3
!X-ENABLE  (via drill 0.6)
  Top 0.254: v29.21,19.56 32.77,19.56 IC2.2
  Bottom 0.254: P1.!EN 13.97,36.83 19.56,36.83 24,32.38 24,24.77 v29.21,19.56
!Y-ENABLE  (via drill 0.6)
  Top 0.254: v30.48,20.83 32.92,20.83 IC2.1
  Bottom 0.254: v30.48,20.83 30.48,38.1 P2.!EN
!Z-ENABLE  (via drill 0.51)
  Top 0.254: v50.29,30.73 49.64,30.73 IC2.42
  Bottom 0.254: P3.!EN 50.29,37.59 v50.29,30.73
A0  (via drill 0.51)
  Top 0.254: U$34.A0 82.55,3.81 v82.55,9.65 | v37.59,24.64 37.21,25.02 37.21,25.21 IC2.61
  Bottom 0.254: v82.55,9.65 82.17,9.4 60.33,9.4 53.47,16.26 48.26,16.26 41.91,22.61 39.62,22.61 v37.59,24.64
A1  (via drill 0.51)
  Top 0.254: U$34.A1 77.47,3.81 v77.47,10.29 | IC2.60 38.65,25.02 38.73,25.02 v38.99,24.77
  Bottom 0.254: v77.47,10.29 60.33,10.29 53.72,16.89 48.39,16.89 42.04,23.24 40.51,23.24 v38.99,24.77
A2  (via drill 0.51)
  Top 0.254: v74.93,11.18 74.93,3.81 U$34.A2 | v40.39,24.89 39.62,25.65 39.12,25.65 39.12,25.66 IC2.59
  Bottom 0.254: v74.93,11.18 60.33,11.18 53.98,17.53 48.51,17.53 42.16,23.88 41.4,23.88 v40.39,24.89
A3  (via drill 0.51)
  Top 0.254: IC2.58 39.48,26.42 40.39,26.42 v41.78,25.02 | U$34.A3 72.39,3.81 v72.39,12.06
  Bottom 0.254: v41.78,25.02 48.64,18.16 54.23,18.16 60.33,12.06 v72.39,12.06
A4  (via drill 0.51)
  Top 0.254: IC2.57 38.35,28.7 40.01,27.05 41.27,27.05 v43.18,25.15 | v69.85,12.95 69.85,3.81 U$34.A4
  Bottom 0.254: v69.85,12.95 60.33,12.95 54.48,18.8 49.53,18.8 v43.18,25.15
ALE
  Top 0.254: IC2.43 50.86,33.07 54.17,33.07 | 54.17,33.07 JP32.2 | 54.17,33.07 54.75,33.58 R13.1
B-THERM
  Top 0.254: IC2.55 38.88,30.35 37.72,30.35 35.56,28.19 31.11,28.19 26.73,23.81 R10.1 22.04,23.81 17.79,19.56 C9.2 17.77,18.79 11.68,12.7 3.56,12.7 JP24.1
E-DIR
  Top 0.254: IC2.44 52.11,35.43 70.23,35.43 71.5,36.7 88.97,36.7 90.17,37.9 P4.DIR
E-MOT-1A
  Bottom 1.778: P4.1A JP7.3
E-MOT-1B
  Bottom 1.778: P4.1B JP7.4
E-MOT-2A
  Bottom 1.778: P4.2A JP7.2
E-MOT-2B
  Bottom 1.778: P4.2B JP7.1
E-MS1
  Top 0.254: R5.1 JP18.1
  Bottom 0.254: JP18.1 P4.MS1
E-MS2
  Bottom 0.254: P4.MS2 JP19.1
E-MS3
  Bottom 0.254: P4.MS3 81.15,40.51 83.69,40.51 JP20.1
E-RESETSLEEP
  Bottom 0.254: P4.!RST P4.!SLP
E-STEP
  Top 0.254: IC2.45 51.63,36.07 69.85,36.07 71.12,37.34 87.06,37.34 87.63,37.91 P4.STEP
E-STOP
  Top 0.254: JP30.1 59.05,5.71 54.61,5.71 50.16,10.16 47.62,12.7 IC2.18
E-THERM
  Top 0.254: IC2.54 39.11,31.24 30.48,31.24 29.78,31.94 R9.1 25.44,31.94 23.59,33.79 C10.2 22.73,33.77 13.47,33.77 4.06,43.18 2.41,43.18 JP22.1
ENDSTOP+V
  Top 0.254: 38.35,2.79 JP28.2 | 48.51,2.79 JP29.2
  Top 0.508: SJ100.2 JP27.2 28.19,2.29 28.57,1.91 37.47,1.91 38.35,2.79 | JP28.2 38.35,2.92 39.37,1.91 47.62,1.91 48.51,2.79 | JP29.2 48.51,2.92 49.53,1.91 57.78,1.91 58.67,2.79 JP30.2
EXP-PWM  (via drill 0.51)
  Top 0.254: IC2.14 42.58,15.81 43.21,15.81 v43.62,15.4
  Bottom 0.254: v43.62,15.4 44.45,14.57 | 44.45,14.57 | 44.45,14.57 52.67,6.35 69.85,6.35 U$34.PWM
GND  (via drill 0.51, 0.51 pad 0.25)
  other vias: 57.91,9.78 53.78,12.51 57.91,34.04 33.4,27.05 48.39,25.15 50.16,21.72 32.26,12.95 33.66,32.38 18.8,16.89 62.87,32.64 69.22,41.91 48.9,41.91 28.57,41.91 28.57,23.62 14.86,35.31
  pour Top (isolate 0.254, rank 6): -6.35,66.04 106.68,66.04 106.68,-2.54 -6.35,-2.54
  pour Bottom (isolate 0.254, rank 6, no thermals): -5.08,64.77 105.41,64.77 105.41,-1.27 -5.08,-1.27
  pour Top (isolate 0.254, rank 2, no thermals): 9.65,53.85 91.44,53.85 91.44,43.43 9.65,43.43
  pour Top (isolate 0.254, rank 2, no thermals): 100.08,50.04 90.42,50.04 90.42,6.6 23.88,6.6 23.88,0.25 100.08,0.25
  pour Top (isolate 0.254, rank 2, no thermals): -0.25,59.69 -0.25,-0.51 23.37,-0.51 23.37,12.7 14.22,12.7 14.22,23.37 21.34,23.37 21.34,32.26 14.99,32.26 14.99,37.85 6.86,37.85 6.86,59.69
  pour Top (isolate 0.254, rank 2, no thermals): 93.47,59.44 93.47,52.58 99.82,52.58 99.82,59.44
HOTBED-GND
  pour Top (no thermals): 1.27,23.62 1.27,20.83 1.27,20.57 1.27,20.32 1.78,19.81 3.3,19.81 3.56,19.81 4.57,18.8 10.67,18.8 11.18,19.3 11.18,20.07 10.67,20.57 8.64,20.57 4.57,24.64 1.78,24.64 1.27,24.13
HOTEND-GND
  pour Top (no thermals): 1.27,36.2 1.27,33.4 1.27,33.15 1.27,32.89 1.78,32.38 3.3,32.38 3.56,32.38 4.57,31.37 10.67,31.37 11.18,31.88 11.18,32.64 10.67,33.15 8.64,33.15 4.57,37.21 1.78,37.21 1.27,36.7
MISO  (via drill 0.51)
  Top 0.254: IC2.13 42.16,16.51 44.32,16.51 v44.7,16.13
  Bottom 0.254: v44.7,16.13 53.85,7.11 86.42,7.11 86.87,6.54 89.98,6.54 U$34.MISO
MOSI  (via drill 0.51)
  Top 0.254: IC2.12 41.93,17.4 v43.43,17.4 | v87.63,7.87 87.63,3.81 U$34.MOSI
  Bottom 0.254: v43.43,17.4 44.7,17.4 54.1,7.87 v87.63,7.87
N$1
  Top 0.508: R1.1 79.69,33.97 LED1.A
N$2
  Top 0.254: R7.1 20.45,15.56 18.43,15.56 13.99,11.11 J1.D-
N$3
  Top 0.254: R7.2 23.75,15.56 31.34,15.56 35.56,19.78 35.56,20 IC2.4
N$4
  Top 0.254: R8.2 23.75,15.05 31.57,15.04 35.96,19.43 36.04,19.43 IC2.5
N$5
  Top 0.254: R8.1 21.14,14.48 20.45,15.05 18.66,15.05 15.24,11.63 15.24,10.39 J1.D+
N$6
  Top 0.762: JP25.2 4.25,50.29 Q3.3
N$7
  Top 0.254: IC2.9 38.35,17.22 38.35,15.49 39.12,14.73 JP34.1
N$8
  Bottom 0.254: 78.99,27.3 arc180 76.96,28.57 arc180 74.93,27.3 76.96,25.27 78.99,27.3
N$9
  Top 0.508: C11.2 35.95,17.05 IC2.7
PB0-SS  (via drill 0.51)
  Top 0.254: IC2.10 40.64,18.4 v40.64,19.05 | v40.64,21.46 47.12,21.46 v49.02,23.37
  Bottom 0.254: v40.64,19.05 v40.64,21.46 | v49.02,23.37 JP31.6
PC0
  Top 0.254: IC2.35 53.94,27.18 63.5,27.18 67.31,30.99 JP31.12
PC1
  Top 0.254: JP31.13 71.12,32.26 67.31,32.26 62.87,27.81 53.4,27.81 IC2.36
PC2
  Top 0.254: IC2.37 52.92,28.45 62.23,28.45 67.31,33.53 JP31.14
PD0-SCL  (via drill 0.51)
  Top 0.254: IC2.25 50.34,17.78 58.48,17.78 v59.5,16.76 | v80.01,12.83 80.01,6.35 U$34.SCL
  Bottom 0.254: v80.01,12.83 74.3,12.83 72.52,14.61 68.07,14.61 65.91,16.76 v59.5,16.76
PD1-SDA  (via drill 0.51)
  Top 0.254: 50.39,18.82 IC2.26 50.95,18.29 59.69,18.29 60.33,17.65 v60.71,17.65 | U$34.SDA 78.74,12.07 v77.11,13.72
  Bottom 0.254: v60.71,17.65 66.17,17.65 68.45,15.37 73.03,15.37 74.69,13.7 77.1,13.7 v77.11,13.72
PD2-RX1  (via drill 0.51)
  Top 0.254: U$34.RX1 76.2,13.59 v74.94,14.85 | IC2.27 51.62,18.8 60.2,18.8 60.45,18.54 v61.66,18.54
  Bottom 0.254: v61.66,18.54 66.42,18.54 68.83,16.13 73.66,16.13 v74.94,14.85
PD3-TX1  (via drill 0.51)
  Top 0.254: v71.12,17.02 73.66,14.48 U$34.TX1 | IC2.28 52.22,19.3 60.64,19.3 v60.9,19.56
  Bottom 0.254: v71.12,17.02 69.09,17.02 66.55,19.56 v60.9,19.56
PD4
  Top 0.254: JP31.5 71.12,22.1 58.93,22.1 56.64,19.81 52.83,19.81 52.13,20.51 IC2.29
PD5
  Top 0.254: IC2.30 53.3,20.45 56.26,20.45 59.44,23.62 65.79,23.62 66.8,24.64 71.12,24.64 JP31.7
PD6
  Top 0.254: IC2.31 53.3,21.63 53.85,21.08 55.88,21.08 59.18,24.38 65.28,24.38 66.8,25.91 JP31.8
PD7
  Top 0.254: JP31.9 71.12,27.18 67.06,27.18 65.02,25.15 58.93,25.15 55.5,21.72 54.33,21.72 IC2.32
PE0
  Top 0.254: IC2.33 54.9,25.84 64.58,25.84 67.18,28.45 JP31.10
PE1
  Top 0.254: JP31.11 71.12,29.72 67.31,29.72 64.14,26.54 54.42,26.54 IC2.34
PE5
  Top 0.254: IC2.19 50.58,10.79 56.77,10.79 66.8,20.83 JP31.4
SCLK  (via drill 0.51)
  Top 0.254: IC2.11 41.9,18.54 v42.04,18.54 | v88.9,8.89 U$34.SCK
  Bottom 0.254: v42.04,18.54 44.58,18.54 54.48,8.64 86.74,8.64 87,8.89 v88.9,8.89
X-DIR
  Top 0.254: IC2.50 37.15,37.72 30.86,37.72 P1.DIR
X-MOT-1A
  Bottom 1.778: P1.1A JP1.3
X-MOT-1B
  Bottom 1.778: P1.1B JP1.4
X-MOT-2A
  Bottom 1.778: P1.2A JP1.2
X-MOT-2B
  Bottom 1.778: P1.2B JP1.1
X-MS1
  Top 0.254: JP9.1 R2.1
  Bottom 0.254: P1.MS1 JP9.1
X-MS2
  Bottom 0.254: P1.MS2 JP10.1
X-MS3
  Bottom 0.254: P1.MS3 20.19,40.51 22.73,40.51 JP11.1
X-RESETSLEEP
  Bottom 0.254: P1.!RST P1.!SLP
X-STEP
  Top 0.254: IC2.51 36.67,37.08 28.96,37.08 P1.STEP
X-STOP
  Top 0.254: JP27.1 32.26,5.08 32.96,5.08 36.83,9.02 IC2.15
XTAL1
  Top 0.254: XTAL.1 51.76,15.88 51.13,15.88 IC2.24
XTAL2
  Top 0.254: IC2.23 50.16,15.73 50.16,14.79 XTAL.2
Y-DIR
  Top 0.254: IC2.48 49.53,37.44 P2.DIR
Y-MOT-1A
  Bottom 1.778: P2.1A JP3.3
Y-MOT-1B
  Bottom 1.778: P2.1B JP3.4
Y-MOT-2A
  Bottom 1.778: P2.2A JP3.2
Y-MOT-2B
  Bottom 1.778: P2.2B JP3.1
Y-MS1
  Top 0.254: JP12.1 R3.1
  Bottom 0.254: P2.MS1 JP12.1
Y-MS2
  Bottom 0.254: P2.MS2 JP13.1
Y-MS3
  Bottom 0.254: P2.MS3 40.51,40.51 43.69,40.51 44.45,41.27 JP14.1
Y-RESETSLEEP
  Bottom 0.254: P2.!RST P2.!SLP
Y-STEP
  Top 0.254: IC2.49 46.99,37.39 P2.STEP
Y-STOP
  Top 0.254: JP28.1 40.89,11.84 IC2.16
Z-DIR
  Top 0.254: IC2.46 51.09,36.7 68.45,36.7 69.85,38.1 P3.DIR
Z-MOT-1A
  Bottom 1.778: P3.1A JP5.3
Z-MOT-1B
  Bottom 1.778: P3.1B JP5.4
Z-MOT-2A
  Bottom 1.778: P3.2A JP5.2
Z-MOT-2B
  Bottom 1.778: P3.2B JP5.1
Z-MS1
  Top 0.254: JP15.1 R4.1
  Bottom 0.254: P3.MS1 JP15.1
Z-MS2
  Bottom 0.254: P3.MS2 JP16.1
Z-MS3
  Bottom 0.254: JP17.1 63.37,40.51 60.83,40.51 P3.MS3
Z-RESETSLEEP
  Bottom 0.254: P3.!RST P3.!SLP
Z-STEP
  Top 0.254: IC2.47 50.55,37.34 66.67,37.34 67.31,37.97 P3.STEP
Z-STOP
  Top 0.254: JP29.1 46.99,7.62 46.99,12.1 IC2.17

### Text on the board
Bottom: Nur
_tsilk: X-MOTOR | 12V PWR | Y-MOTOR | 12V PWR | Z-MOTOR | 12V PWR | E-MOTOR | 2B | 2A | 1A | 1B | GND | +12V | 2B | 2A | 1A | 1B | GND | +12V | 2B | 2A | 1A | 1B | GND | +12V | 2B | 2A | 1A | 1B | FAN | C5 | Q3 | Extruder | C1 | C2 | C3 | C4 | +12V | Therm. | MS1 | MS2 | MS3 | MS1 | MS2 | MS3 | MS1 | MS2 | MS3 | MS1 | MS2 | MS3 | R2 | R3 | R4 | R5 | LM7805 | Hot End | R14 | Extruder | X-Axis | Y-Axis | Z-Axis | -V | - | + | C6 | C10 | R9 | R13 | R1 | C13 | C16 | ATX+4 | +12V | R6 | ALE | POWER LED | Q1 | R11 | 12V | GND | Bed | C12 | C7 | -V | R10 | GND | SCREW | +12V | C9 | R7 | C11 | RESET | Q2 | R12 | Hot Bed | Therm. | R8 | S1 | 12V | Endstop Voltage | 5V | C14 | ver 0.7 | Teensylu | reprap.org/wiki/Teensylu | PWM | TX1 | RX1 | SDA | SCL | E-STOP | GND | +V | SIG | X-STOP | GND | +V | SIG | Y-STOP | GND | +V | SIG | Z-STOP | GND | +V | SIG | 12V | 5V | D12 | D11 | D10 | D17 | D16 | !RESET | SCK | MISO | ISP/SPI | GND | GND | A4 | A3 | A2 | A1 | A0 | GND | MOSI | 5V